# Altium schematic sheet Copy of Motor-28.SchDoc
size B; SheetNumber: 1; SheetTotal: 1
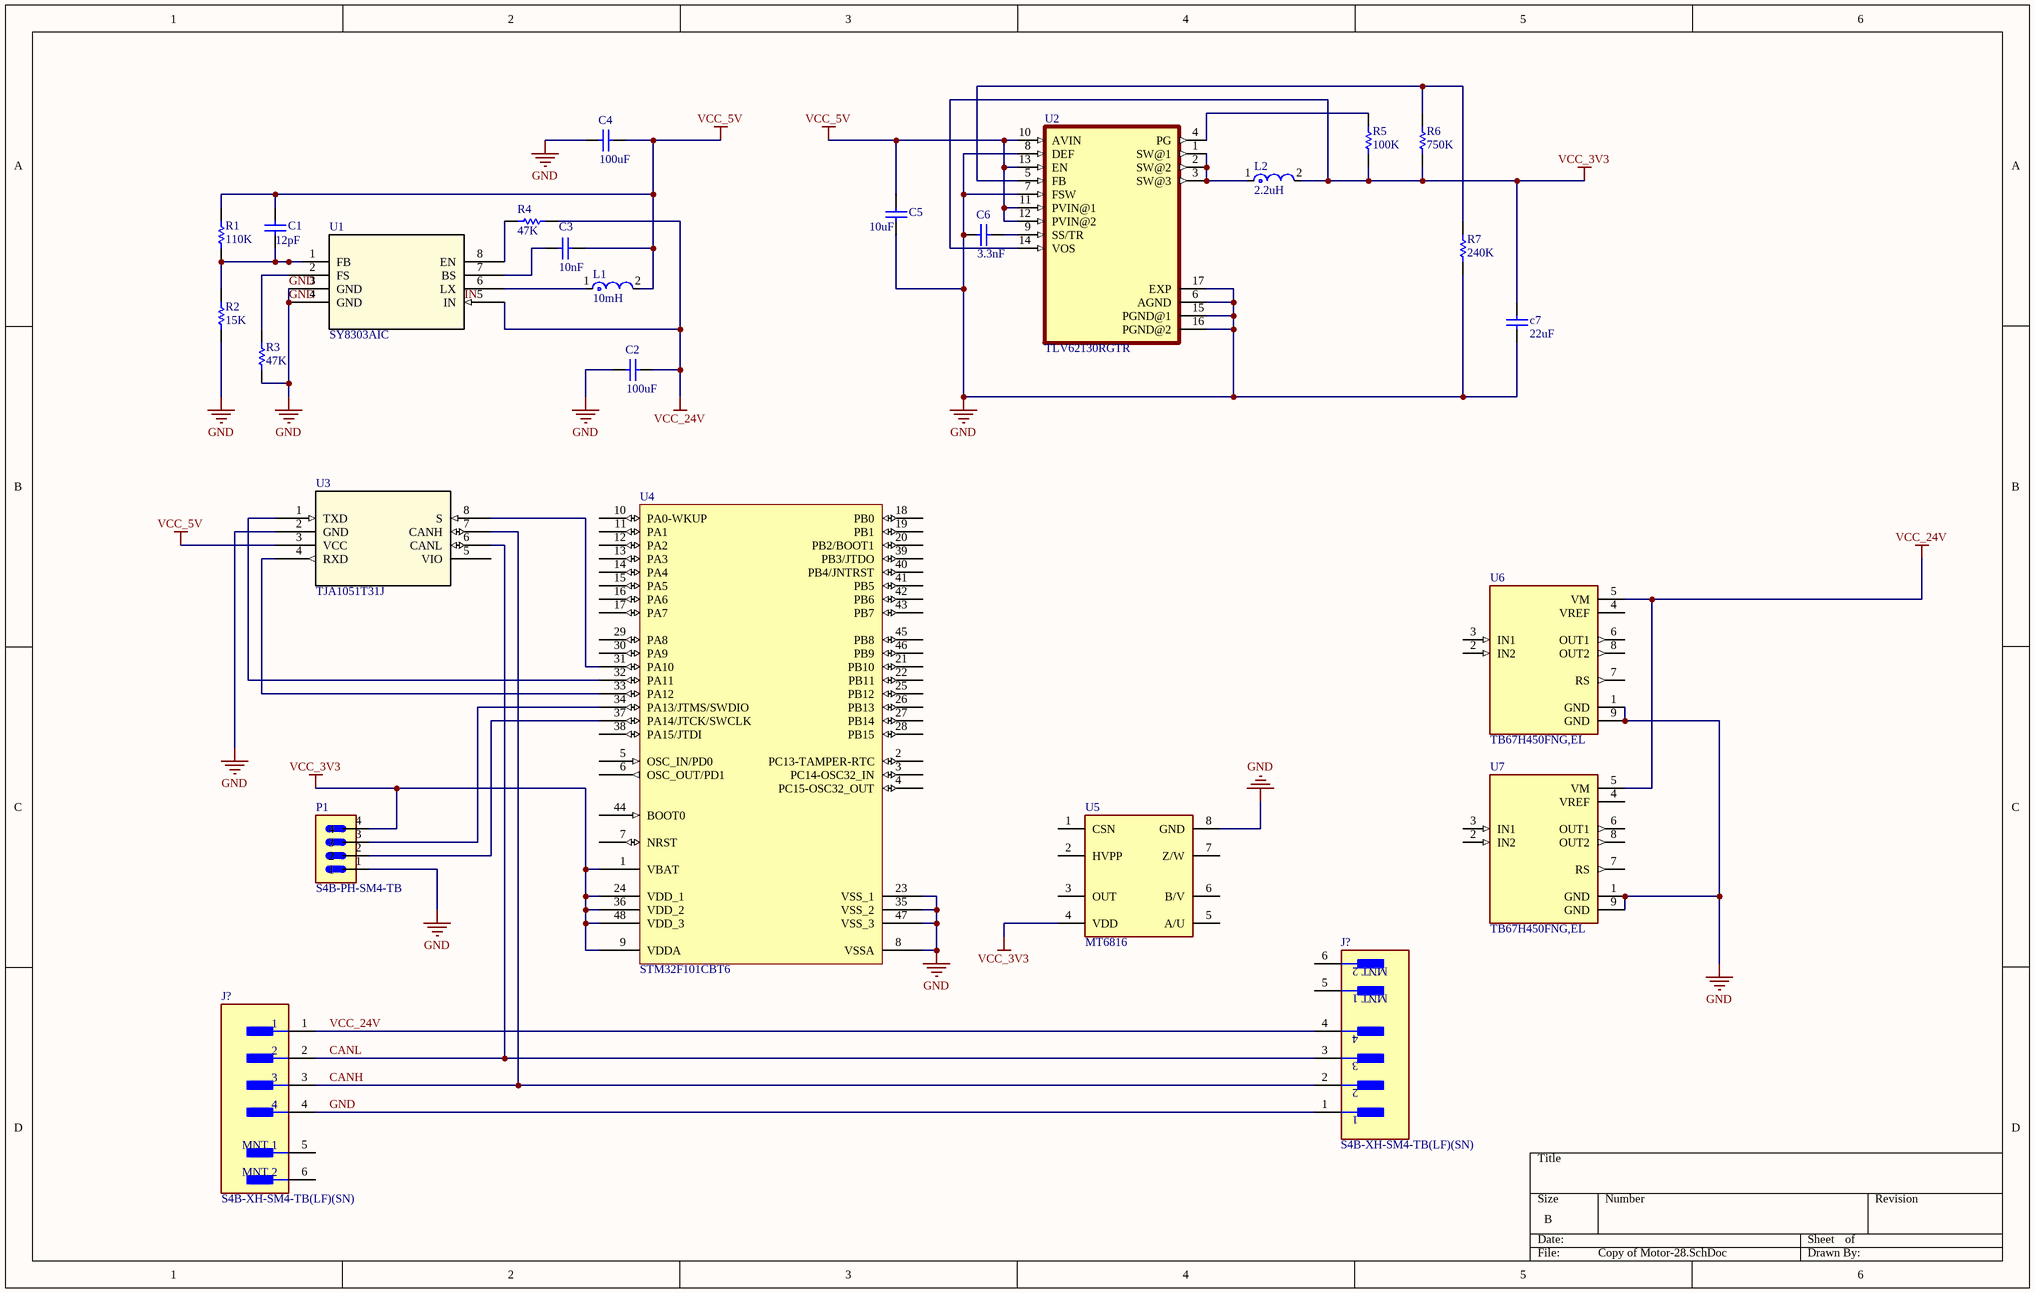
[diagram p0: Copy of Motor-28.SchDoc]

## Parts
(Parts that share a designator on the sheet are numbered #1, #2 ... from top to bottom, then left to right.)
C1  12pF  [CAPC1608X90X35ML10T15]
C2  100uF  [CAPC1608X90X35ML10T15]
C3  10nF  [CAPC1608X90X35ML10T15]
C4  100uF  [CAPC1608X90X35ML10T15]
C5  10uF  [CAPC1608X90X35ML10T15]
C6  3.3nF  [CAPC1608X90X35ML10T15]
c7  22uF  [CAPC1608X90X35ML10T15]
J?#1  S4B-XH-SM4-TB(LF)(SN)  [FP-S4B-XH-SM4-TB_LF_SN-MFG]
J?#2  S4B-XH-SM4-TB(LF)(SN)  [FP-S4B-XH-SM4-TB_LF_SN-MFG]
L1  10mH  [FP-LQG18HH_00-MFG]
L2  2.2uH  [FP-LQG18HH_00-MFG]
P1  S4B-PH-SM4-TB  [JST_S4B-PH-SM4-TB]
R1  110K  [RESC1608X55X30ML20T20]
R2  15K  [RESC1608X55X30ML20T20]
R3  47K  [RESC1608X55X30ML20T20]
R4  47K  [RESC1608X55X30ML20T20]
R5  100K  [RESC1608X55X30ML20T20]
R6  750K  [RESC1608X55X30ML20T20]
R7  240K  [RESC1608X55X30ML20T20]
U1  SY8303AIC  [TSOT_303AIC_SGY]
U2  TLV62130RGTR  [QFN50P300X300X100-17N]
U3  TJA1051T31J  [SO8_SOT96-1_NXP]
U4  STM32F101CBT6  [LQFP48_N]
U5  MT6816  [SOIC127P600X175-8N-8-V]
U6  TB67H450FNG,EL  [SOIC127P599X175-9N]
U7  TB67H450FNG,EL  [SOIC127P599X175-9N]

## Nets
GND: C2.1 C4.1 C5.1 C6.1 c7.1 J?#1.4 J?#2.1 P1.1 R2.1 R3.1 R7.1 U1.3(GND) U1.4(GND) U2.6(AGND) U2.7(FSW) U2.8(DEF) U2.15(PGND@1) U2.16(PGND@2) U2.17(EXP) U3.2(GND) U4.8(VSSA) U4.23(VSS_1) U4.35(VSS_2) U4.47(VSS_3) U5.8(GND) U6.1(GND) U6.9(GND) U7.1(GND) U7.9(GND)
VCC_3V3: c7.2 L2.2 P1.4 R5.1 R6.1 U2.14(VOS) U4.1(VBAT) U4.9(VDDA) U4.24(VDD_1) U4.36(VDD_2) U4.48(VDD_3) U5.4(VDD)
VCC_5V: C1.2 C3.2 C4.2 C5.2 L1.2 R1.2 U2.10(AVIN) U2.11(PVIN@1) U2.12(PVIN@2) U2.13(EN) U3.3(VCC)
VCC_24V: C2.2 J?#1.1 J?#2.4 R4.2 U1.5(IN) U6.5(VM) U7.5(VM)
CANH: J?#1.3 J?#2.2 U3.7(CANH)
CANL: J?#1.2 J?#2.3 U3.6(CANL)
NetC1_1: C1.1 R1.1 R2.2 U1.1(FB)
NetC3_1: C3.1 U1.7(BS)
NetC6_2: C6.2 U2.9(SS/TR)
NetL1_1: L1.1 U1.6(LX)
NetL2_1: L2.1 U2.1(SW@1) U2.2(SW@2) U2.3(SW@3)
NetP1_2: P1.2 U4.37(PA14/JTCK/SWCLK)
NetP1_3: P1.3 U4.34(PA13/JTMS/SWDIO)
NetR3_2: R3.2 U1.2(FS)
NetR4_1: R4.1 U1.8(EN)
NetR5_2: R5.2 U2.4(PG)
NetR6_2: R6.2 R7.2 U2.5(FB)
NetU3_1: U3.1(TXD) U4.32(PA11)
NetU3_4: U3.4(RXD) U4.33(PA12)
NetU3_8: U3.8(S) U4.31(PA10)

Not connected (* = marked no-connect by the designer): J?#1 5(MNT_1) 6(MNT_2); J?#2 5(MNT_1) 6(MNT_2); U3 5(VIO); U4 2(PC13-TAMPER-RTC) 3(PC14-OSC32_IN) 4(PC15-OSC32_OUT) 5(OSC_IN/PD0) 6(OSC_OUT/PD1) 7(NRST) 10(PA0-WKUP) 11(PA1) 12(PA2) 13(PA3) 14(PA4) 15(PA5) 16(PA6) 17(PA7) 18(PB0) 19(PB1) 20(PB2/BOOT1) 21(PB10) 22(PB11) 25(PB12) 26(PB13) 27(PB14) 28(PB15) 29(PA8) 30(PA9) 38(PA15/JTDI) 39(PB3/JTDO) 40(PB4/JNTRST) 41(PB5) 42(PB6) 43(PB7) 44(BOOT0) 45(PB8) 46(PB9); U5 1(CSN) 2(HVPP) 3(OUT) 5(A/U) 6(B/V) 7(Z/W); U6 2(IN2) 3(IN1) 4(VREF) 6(OUT1) 7(RS) 8(OUT2); U7 2(IN2) 3(IN1) 4(VREF) 6(OUT1) 7(RS) 8(OUT2)

## Notes on the sheet
- Labels drawn without touching a wire or pin: IN

## Library data of the parts
C1-C6 c7 = CMP-2006-02924-1: Part Number: GRM188R71H472KA01D; Manufacturer: Murata
J?#1 J?#2 = CMP-17439-000072-1: CONN HEADER SMD R/A 4POS 2.5MM; Number of Positions: 4; Max Current Rating: 3A; Max Voltage Rating (AC): 250V; Connector Type: Male Pin; Contact Resistance: 20mR; Gender: Male; Pitch: 0.098inch; Max Operating Temperature: 85°C; Contact Plating: Tin; Housing Material: Polyamide; Housing Color: Beige; Depth: 10mm; Series: XH; Package Quantity: 1; Length: 15mm; Contact Material: Copper Alloy; Min Operating Temperature: -25°C; REACH SVHC: No SVHC; Orientation: Right Angle; Number of Rows: 1; Contact Type: Male Pin; Color: Natural; Lead Free: Lead Free; Termination: Solder; Mount: Surface Mount; Number of Contacts: 4; Packaging: Tape and Reel
L1 L2 = CMP-06042-006563-1: Multilayer type RF Inductor 68nH ±5% 0.8Ω 400mA 0603; Core Material: Air; DC Current: 300mA; Q Factor: 12; Test Frequency: 100MHz; DC Resistance (DCR): 800mR; Shielding: Unshielded; Self Resonant Frequency: 1GHz; Termination: SMD/SMT; Mount: Surface Mount; Case Code (Imperial): 0603; Height: 0.031inch; Tolerance: 5%; Inductance Tolerance: 5%; Package Quantity: 4000; Width: 0.8mm; Length: 0.063inch; Inductance: 68nH; Depth: 0.95mm; Case Code (Metric): 1608; Max DC Current: 300mA; Case/Package: 0603; Military Standard: Not; Min Operating Temperature: -55°C; REACH SVHC: No SVHC; Number of Pins: 2; Max Operating Temperature: 85°C; Lead Free: Lead Free; Current Rating: 300mA; Radiation Hardening: No; Packaging: Tape and Reel
P1 = S4B-PH-SM4-TB: Connector Header Surface Mount, Right Angle 4 position 0.079 _2.00mm_; MF: JST Sales; Package: None; Value: *; Availability: Unavailable; SnapEDA_Link: https://www.snapeda.com/parts/S4B-PH-SM4-TB/JST%20Sales%20America%20Inc./view-part/473686/?ref=snap; Price: None; MP: S4B-PH-SM4-TB
R1-R7 = CMP-2000-00054-1: Part Number: ERA3AEB392V; Manufacturer: Panasonic
U1 = SY8303AIC: No Description Available; Mfr_Name: Silergy; RefDes: RefDes; Type: Type
U2 = TLV62130RGTR: 3-17V 3A Step-Down Converter in 3x3 QFN Package 16-VQFN -40 to 85; MF: Texas Instruments; Mouser-Purchase-URL: https://snapeda.com/shop?store=Mouser&id=423292; MP: TLV62130RGTR; Value: *; DigiKey-Purchase-URL: https://snapeda.com/shop?store=DigiKey&id=423292; Package: VQFN-16 Texas Instruments; Texas_Instruments-Purchase-URL: https://snapeda.com/shop?store=Texas+Instruments&id=423292; Price: None; Availability: Unavailable; SnapEDA_Link: https://www.snapeda.com/parts/TLV62130RGTR/Texas%20Instruments/view-part/423292/?ref=snap
U3 = TJA1051T31J: No Description Available; Mfr_Name: NXP; RefDes: RefDes; Type: Type
U4 = STM32F101CBT6: STM32 ARM-based 32-bit MCU with 128 Kbytes Flash, 48-pin LQFP, Industrial Temperature; Published: 30-May-2008; DatasheetVersion: rev6, Mar-2008; PackageVersion: Mar-2008; PackageReference: LQFP48; Publisher: Altium Limited; PackageDescription: 48-Pin Low-Profile Quad Flat Pack, 7 x 7 mm Body, 0.5 mm Pitch (LQFP48); ComponentLink1Description: Manufacturer Link; ComponentLink1URL: www.st.com/stm32; ComponentLink2Description: Datasheet; ComponentLink2URL: http://www.st.com/stonline/products/literature/ds/13586.pdf
U5 = TLE5012B_E1000: TLE5012B/TLI5012B Angular and Linear Position Sensor Evaluation Board Automotive; MF: Infineon Technologies; MP: TLE5012B E1000; Package: SOIC-8 Infineon Technologies; Price: None; Value: *; SnapEDA_Link: https://www.snapeda.com/parts/TLE5012B%20E1000/Infineon+Technologies/view-part/?ref=snap; Availability: In Stock; Check_prices: https://www.snapeda.com/parts/TLE5012B%20E1000/Infineon+Technologies/view-part/?ref=eda
U6 U7 = TB67H450FNG,EL: - Motor Driver - - 8-HSOP; MF: Toshiba Semiconductor and Storage; Package: SOIC-8 Toshiba Semiconductor and Storage; Price: None; Check_prices: https://www.snapeda.com/parts/TB67H450FNG,EL/Toshiba+Semiconductor+and+Storage/view-part/?ref=eda; Value: *; SnapEDA_Link: https://www.snapeda.com/parts/TB67H450FNG,EL/Toshiba+Semiconductor+and+Storage/view-part/?ref=snap; MP: TB67H450FNG,EL; Availability: In Stock; Purchase-URL: https://pricing.snapeda.com/search?q=TB67H450FNG,EL&ref=eda